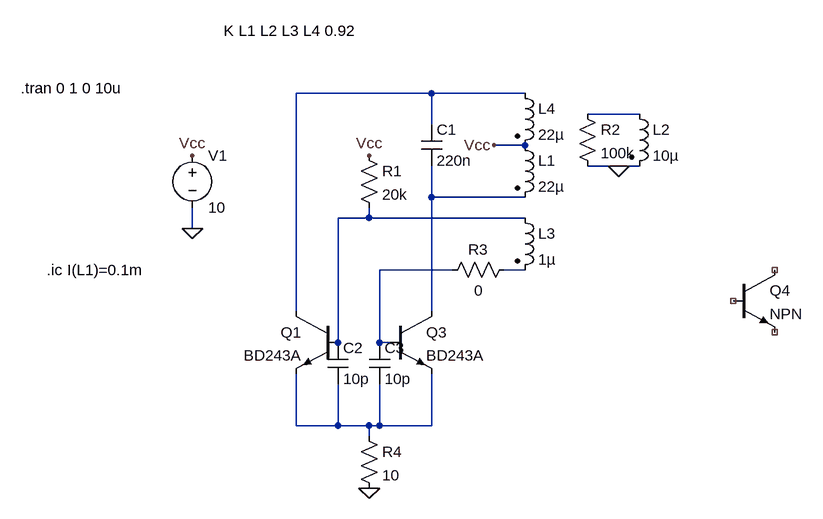
[diagram p0: schematic eoyer.asc]
eoyer.asc, the LTspice schematic file:
Version 4
SHEET 1 880 680
WIRE 240 16 32 16
WIRE 384 16 240 16
WIRE 560 48 480 48
WIRE 240 64 240 16
WIRE 384 96 336 96
WIRE 528 128 480 128
WIRE 560 128 528 128
WIRE 240 176 240 128
WIRE 384 176 240 176
WIRE 144 208 144 192
WIRE 144 208 96 208
WIRE 384 208 144 208
WIRE -128 224 -128 192
WIRE 272 288 160 288
WIRE 384 288 352 288
WIRE 32 352 32 16
WIRE 240 352 240 176
WIRE 96 400 96 208
WIRE 160 400 160 288
WIRE 176 400 160 400
WIRE 32 528 32 448
WIRE 96 528 96 464
WIRE 96 528 32 528
WIRE 144 528 96 528
WIRE 160 528 160 464
WIRE 160 528 144 528
WIRE 240 528 240 448
WIRE 240 528 160 528
WIRE 144 544 144 528
FLAG -128 224 0
FLAG -128 112 Vcc
FLAG 144 624 0
FLAG 336 96 Vcc
FLAG 144 112 Vcc
FLAG 528 128 0
SYMBOL voltage -128 96 R0
WINDOW 123 0 0 Left 0
WINDOW 39 0 0 Left 0
SYMATTR InstName V1
SYMATTR Value 10
SYMBOL ind2 368 80 R0
SYMATTR InstName L1
SYMATTR Value 22µ
SYMATTR Type ind
SYMBOL ind2 544 32 R0
SYMATTR InstName L2
SYMATTR Value 10µ
SYMATTR Type ind
SYMBOL ind2 368 192 R0
SYMATTR InstName L3
SYMATTR Value 1µ
SYMATTR Type ind
SYMATTR SpiceLine Rser=0.1
SYMBOL npn 96 352 M0
SYMATTR InstName Q1
SYMATTR Value BD243A
SYMBOL ind2 368 0 R0
SYMATTR InstName L4
SYMATTR Value 22µ
SYMATTR Type ind
SYMBOL cap 224 64 R0
SYMATTR InstName C1
SYMATTR Value 220n
SYMBOL res 128 96 R0
SYMATTR InstName R1
SYMATTR Value 20k
SYMBOL res 464 32 R0
SYMATTR InstName R2
SYMATTR Value 100k
SYMBOL res 368 272 R90
WINDOW 0 0 56 VBottom 2
WINDOW 3 32 56 VTop 2
SYMATTR InstName R3
SYMATTR Value 0
SYMBOL npn 704 288 R0
SYMATTR InstName Q4
SYMBOL res 128 528 R0
SYMATTR InstName R4
SYMATTR Value 10
SYMBOL npn 176 352 R0
SYMATTR InstName Q3
SYMATTR Value BD243A
SYMBOL cap 80 400 R0
SYMATTR InstName C2
SYMATTR Value 10p
SYMBOL cap 144 400 R0
SYMATTR InstName C3
SYMATTR Value 10p
TEXT -80 -80 Left 2 !K L1 L2 L3 L4 0.92
TEXT -392 8 Left 2 !.tran 0 1 0 10u
TEXT -352 288 Left 2 !.ic I(L1)=0.1m

The netlist it stands for:
* eoyer.asc
V1 Vcc 0 10
L1 Vcc N003 22µ
L2 N002 0 10µ
L3 N004 N006 1µ Rser=0.1
Q1 N001 N004 N007 0 BD243A
L4 N001 Vcc 22µ
C1 N001 N003 220n
R1 Vcc N004 20k
R2 N002 0 100k
R3 N006 N005 0
Q4 NC_01 NC_02 NC_03 0 NPN
R4 N007 0 10
Q3 N003 N005 N007 0 BD243A
C2 N004 N007 10p
C3 N005 N007 10p
.model NPN NPN
.model PNP PNP
.lib standard.bjt
K L1 L2 L3 L4 0.92
.tran 0 1 0 10u
.ic I(L1)=0.1m
.backanno
.end